# Altium project MCU099_LP-MSPM0L1306.PrjPcb (part 3 of 3)

## Sheet MCU099_04_XDS110_Target_Interface.SchDoc: XDS110-ET Interface
size 431 x 279 mm; DrawnBy: Johnson He; SheetNumber: 4; SheetTotal: 6; PageSetup: Record=PageOptions|CenterHorizontal=True|CenterVertical=True|PrintScale=0.97|XCorrection=1.00|YCorrection=1.00|PrintKind=0|BorderSize=5000000|LeftOffset=0|BottomOffset=0|Orientation=2|PaperLength=1000|PaperWidth=1000|Scale=100|PaperSource=15|PrintQuality=600|MediaType=1|DitherType=10|PaperKind=Letter|PrintScaleMode=1
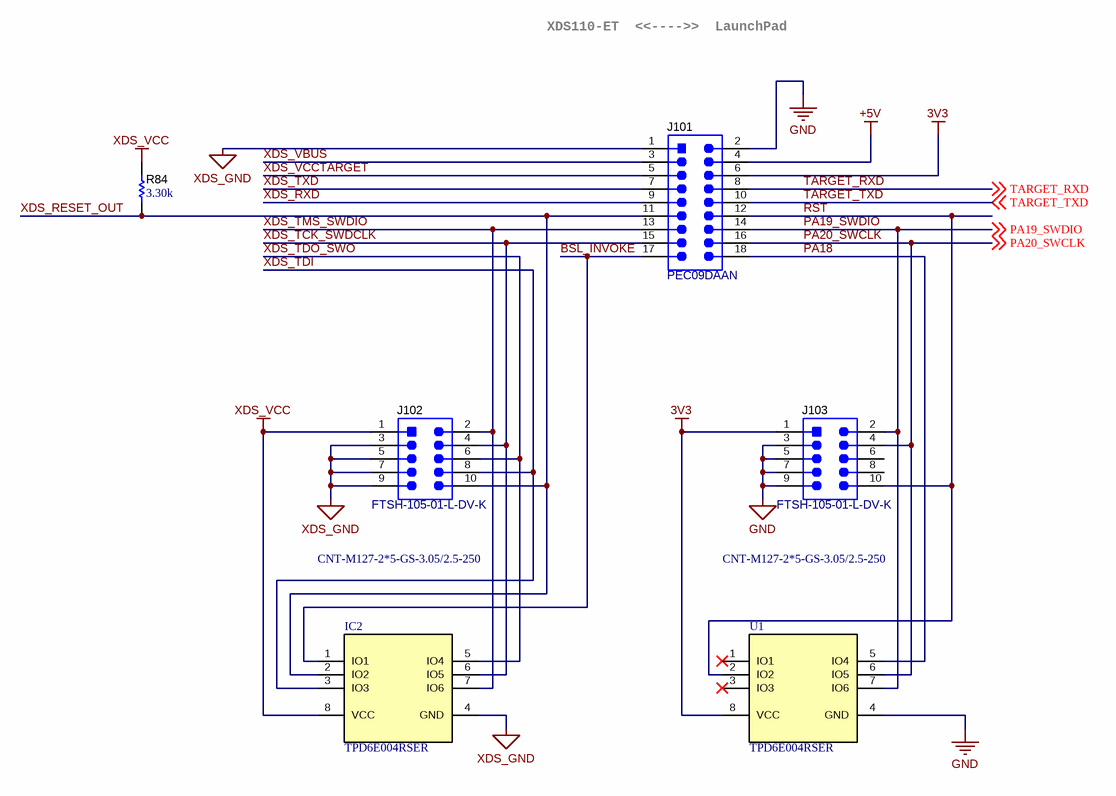
[diagram p3: MCU099_04_XDS110_Target_Interface.SchDoc]

### Parts
IC2  TPD6E004RSER  [RSE0008A]
J101  PEC09DAAN  [Sullins_PxC09DAAN]
J102  FTSH-105-01-L-DV-K  [Samtec_FTSH-105-01-x-DV-K]
J103  FTSH-105-01-L-DV-K  [Samtec_FTSH-105-01-x-DV-K]
R84  ValueDisplayed: 3.30k  [0402]  (hidden comment: ERJ-2RKF3301X)
U1  TPD6E004RSER  [RSE0008A]

### Nets
3V3: J101.6 J103.1 U1.8(VCC)
+5V: J101.4
GND: J101.2 J103.3 J103.5 J103.7 J103.9 U1.4(GND)
XDS_GND: IC2.4(GND) J101.1 J102.3 J102.5 J102.7 J102.9
XDS_VCC: IC2.8(VCC) J102.1 R84.2
BSL_INVOKE: IC2.1(IO1) J101.17
PA18: J101.18 U1.5(IO4)
PA19_SWDIO: J101.14 J103.2 U1.7(IO6) ; off-sheet PA19_SWDIO  [project net PA19]
PA20_SWCLK: J101.16 J103.4 U1.6(IO5) ; off-sheet PA20_SWCLK  [project net PA20]
~{RST}: J101.12 J103.10 U1.2(IO2)
TARGET_RXD: J101.8 ; off-sheet TARGET_RXD  [project net BC_RX]
TARGET_TXD: J101.10 ; off-sheet TARGET_TXD  [project net BC_TX]
XDS_RESET_OUT: IC2.2(IO2) J101.11 J102.10 R84.1
XDS_RXD: J101.9
XDS_TCK_SWDCLK: IC2.6(IO5) J101.15 J102.4
XDS_TDI: IC2.3(IO3) J102.8
XDS_TDO_SWO: IC2.5(IO4) J102.6
XDS_TMS_SWDIO: IC2.7(IO6) J101.13 J102.2
XDS_TXD: J101.7
XDS_VBUS: J101.3
XDS_VCCTARGET: J101.5

Not connected (* = marked no-connect by the designer): J103 6 8; U1 1(IO1)* 3(IO3)*

### Notes on the sheet
- XDS110-ET  <<---->>  LaunchPad
- CNT-M127-2*5-GS-3.05/2.5-250
- Drawn By:
- SVN Rev:
- Number:
- TID #:
- Orderable:
- Rev:
- Sheet Title:
- File:
- Project Title:
- Designed for:
- Assembly Variant:
- Mod. Date:
- Sheet:
- Size:
- of
- B
- http://www.ti.com
- Texas Instruments and/or its licensors do not warrant the accuracy or completeness of this specification or any information contained therein. Texas Instruments and/or its licensors do not warrant that this design will meet the specifications, will be suitable for your application or fit for any particular purpose, or will operate in an implementation. Texas Instruments and/or its licensors do not warrant that the design is production worthy. You should completely validate and test your design implementation to confirm the system functionality for your application.
- Engineer:
- Contact:
- © Texas Instruments

### Library data of the parts
IC2 U1 = CMP-0043125-2: Low-Capacitance + / - 15 kV ESD Protection Array for High-Speed Data Interfaces, 6 Channels, -40 to +85 degC, 8-pin UQFN (RSE), Green (RoHS & no Sb/Br); Manufacturer: Texas Instruments; IO Leakage Current(nA): 1; IO Capacitance(Typ)(pF): 1.6; 1394 / Firewire: TRUE; SubFamily: ESD Solution; Breakdown Voltage(Min)(V): 6; IEC 61000-4-2 Air-Gap(+/- kV): 12; IEC 61000-4-2 Contact(+/- kV): 8; ComponentLink1URL: http://www.ti.com/; PackageDescription: 8-Pin Plastic Quad Flatpack No-Lead, 1.5 x 1.5 mm Body, 0.5 mm Pitch; Serial ATA / eSATA: TRUE; ComponentLink2URL: http://www.ti.com/general/docs/lit/getliterature.tsp?genericPartNumber=TPD6E004&fileType=pdf; ComponentLink3Description: URL Link1; Eco-Plan: Green (RoHS & no Sb/Br); USB High Speed: TRUE; ComponentLink2Description: Datasheet; ComponentLink3URL: SamplesURL:http://www.ti.com/product/tpd6e004#samples; PackageReference: RSE0008A; DatasheetVersion: SLLS799A; PartNumber: TPD6E004RSER; PackageVersion: revD, Jan-2011; Mounting Technology: Surface Mount; ComponentLink1Description: Manufacturer URL
J101 = CMP-0054622-1: Header, 2.54mm, 9x2, Tin, TH; Manufacturer: Sullins Connector Solutions; CNHeader: TRUE; Current_A: 3A; Shrouded: N; Gender: Male; Row_Count: 2; RowSpacing_mm: 2.54; CT: FALSE; Cert_UL: Y; ComponentLink1URL: http://www.sullinscorp.com/catalogs/77_PAGE108-109_.100_MALE_HDR.pdf; ClassName: Header; Publisher: Texas Instruments; Color: Black; RoHS: Y; MountType: TH; Supplier 1: Digi-Key; PackageReference: Header, 2.54mm, 9x2, TH; PinCount: 18; CompType: Header; LatestRevisionDate: 26/05/2017; PartNumber: PEC09DAAN; Orientation: Vertical; ComponentLink1Description: Datasheet URL; Supplier Part Number 1: S2012E-09-ND; Pitch_mm: 2.54; ContactFinish: Tin
J102 J103 = CMP-0075634-1: Header(Shrouded), 1.27mm, 5x2, Gold, SMT; Manufacturer: Samtec; Pitch_mm: 1.27; Gender: Male; Cert_CSA: Y; Current_A: 3.3A; CT: False; Row_Count: 2; ComponentLink1Description: Datasheet URL; RoHS: Y; Supplier 1: Digi-Key; Cert_UL: Y; Orientation: Vertical; PackageReference: Header(Shrouded), 1.27mm, 5x2, SMT; Color: Black; PartNumber: FTSH-105-01-L-DV-K; PinCount: 10; Publisher: Texas Instruments; Supplier Part Number 2: 1872577; ContactFinish: Gold; Supplier 2: Farnell; Shrouded: Y; RowSpacing_mm: 1.27; ComponentLink1URL: http://suddendocs.samtec.com/prints/ftsh-1xx-xx-xxx-dv-xxx-mkt.pdf; LatestRevisionDate: 2017-07-12; CompType: Header; CNHeader: False; MountType: SMT; Supplier Part Number 1: SAM8799-ND
R84 = CMP-0026695-1: RES, 3.30 k, 1%, 0.1 W, AEC-Q200 Grade 0, 0402; Manufacturer: Panasonic; Power_W: 100mW; TempCo: 100 ppm/C; Value_Code: 3k30; U/M: EA; Value: 3.30k; Res_ohm: 3.3k; SizeX_mm: 1; SizeY_mm: 0.5; SizeZ_mm: 0.6; Value2: 0.1W; AEC Qualified: Y; VDC_V: 50V; AEC Grade: 0; AEC Category: Q200; ComponentLink1URL: http://industrial.panasonic.com/cdbs/www-data/pdf/RDA0000/AOA0000C86.pdf; Supplier Part Number 2: 64R5278; Publisher: Texas Instruments; Supplier 2: Newark; Supplier Part Number 3: 667-ERJ-2RKF3301X; Supplier 3: Mouser; Published: 2008-06-26; RoHS: Y; Value1: 1%; MountType: SMT; Supplier 1: Digi-Key; PackageReference: 0402; Tolerance_%: 1%; SizeArea_mm2: 0.5; CompType: Resistor; LatestRevisionDate: 2017-03-09; PartNumber: ERJ-2RKF3301X; ComponentLink1Description: Datasheet link; Supplier Part Number 1: P3.30KLCT-ND; Technology: Thick Film

## Sheet MCU099_05_XDS110-ET_USB_Power.SchDoc: XDS110-ET USB Power
size 431 x 279 mm; DrawnBy: Johnson He; SheetNumber: 5; SheetTotal: 6; PageSetup: Record=PageOptions|CenterHorizontal=True|CenterVertical=True|PrintScale=0.97|XCorrection=1.00|YCorrection=1.00|PrintKind=0|BorderSize=5000000|LeftOffset=0|BottomOffset=0|Orientation=2|PaperLength=1000|PaperWidth=1000|Scale=100|PaperSource=15|PrintQuality=600|MediaType=1|DitherType=10|PaperKind=Letter|PrintScaleMode=1
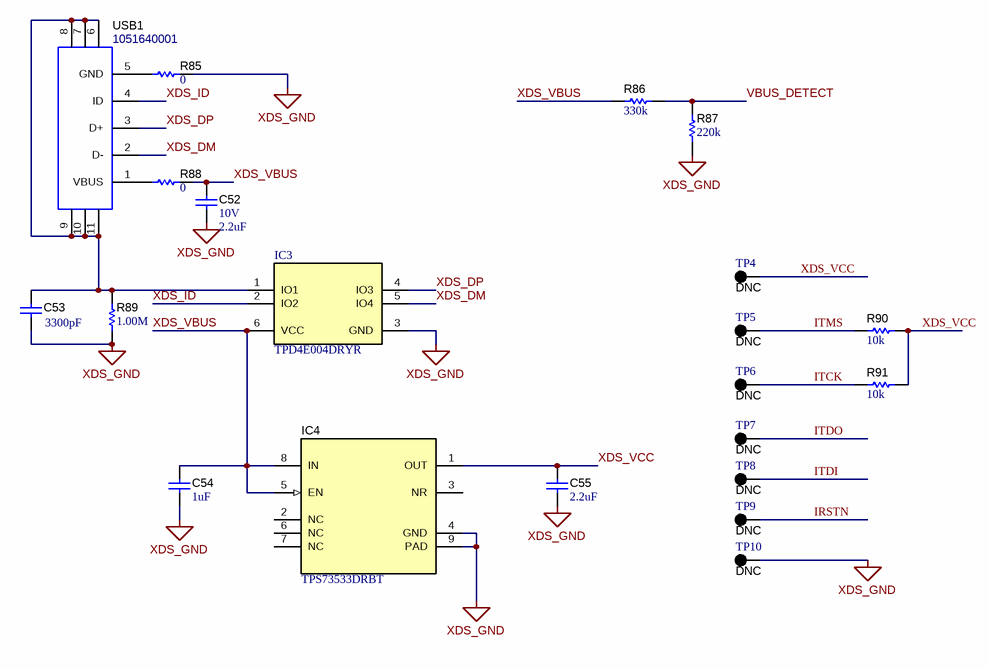
[diagram p4: MCU099_05_XDS110-ET_USB_Power.SchDoc]

### Parts
(Parts that share a designator on the sheet are numbered #1, #2 ... from top to bottom, then left to right.)
C52  VDC_V: 10V  ValueDisplayed: 2.2uF  [0603]  (hidden comment: C0603C225K8PACTU)
C53  ValueDisplayed: 3300pF  [0402]  (hidden comment: GRM155R71H332KA01D)
C54  ValueDisplayed: 1uF  [0402]  (hidden comment: C1005X5R1E105K050BC)
C55  ValueDisplayed: 2.2uF  [0402]  (hidden comment: GRM155R60J225KE95D)
IC3  TPD4E004DRYR  [DRY0006A]
IC4  TPS73533DRBT  [DRB0008A]
R85  ValueDisplayed: 0  [0603]  (hidden comment: RC0603JR-070RL)
R86  ValueDisplayed: 330k  [0402]  (hidden comment: RC0402FR-07330KL)
R87  ValueDisplayed: 220k  [0402]  (hidden comment: RC0402FR-07220KL)
R88  ValueDisplayed: 0  [0603]  (hidden comment: RC0603JR-070RL)
R89  ValueDisplayed: 1.00M  [0402]  (hidden comment: CRCW04021M00FKED)
R90  ValueDisplayed: 10k  [0402]  (hidden comment: CRCW040210K0JNED)
R91  ValueDisplayed: 10k  [0402]  (hidden comment: CRCW040210K0JNED)
TP4  DNC  [Keystone5001]  (no BOM)
TP5  DNC  [Keystone5001]  (no BOM)
TP6  DNC  [Keystone5001]  (no BOM)
TP7  DNC  [Keystone5001]  (no BOM)
TP8  DNC  [Keystone5001]  (no BOM)
TP9  DNC  [Keystone5001]  (no BOM)
TP10  DNC  [Keystone5001]  (no BOM)
USB1#1  1051640001  [Molex_1051640001]

### Nets
XDS_GND: C52.2 C53.2 C54.2 C55.2 IC3.3(GND) IC4.4(GND) IC4.9(PAD) R85.2 R87.1 R89.1 TP10.1
XDS_VCC: C55.1 IC4.1(OUT) R90.1 R91.1 TP4.1
IRSTN: TP9.1
ITCK: R91.2 TP6.1
ITDI: TP8.1
ITDO: TP7.1
ITMS: R90.2 TP5.1
VBUS_DETECT: R86.2 R87.2
XDS_DM: IC3.5(IO4) USB1#1.2(D-)
XDS_DP: IC3.4(IO3) USB1#1.3(D+)
XDS_ID: IC3.2(IO2) USB1#1.4(ID)
XDS_VBUS: C52.1 C54.1 IC3.6(VCC) IC4.5(EN) IC4.8(IN) R86.1 R88.2
NetC53_1: C53.1 IC3.1(IO1) R89.2 USB1#1.6 USB1#1.7 USB1#1.8 USB1#1.9 USB1#1.10 USB1#1.11
NetR85_1: R85.1 USB1#1.5(GND)
NetR88_1: R88.1 USB1#1.1(VBUS)

Not connected (* = marked no-connect by the designer): IC4 2(NC) 3(NR) 6(NC) 7(NC)

### Notes on the sheet
- Drawn By:
- SVN Rev:
- Number:
- TID #:
- Orderable:
- Rev:
- Sheet Title:
- File:
- Project Title:
- Designed for:
- Assembly Variant:
- Mod. Date:
- Sheet:
- Size:
- of
- B
- http://www.ti.com
- Texas Instruments and/or its licensors do not warrant the accuracy or completeness of this specification or any information contained therein. Texas Instruments and/or its licensors do not warrant that this design will meet the specifications, will be suitable for your application or fit for any particular purpose, or will operate in an implementation. Texas Instruments and/or its licensors do not warrant that the design is production worthy. You should completely validate and test your design implementation to confirm the system functionality for your application.
- Engineer:
- Contact:
- © Texas Instruments

### Library data of the parts
C52 = CMP-0006906-5: CAP, CERM, 2.2 uF, 10 V, +/- 10%, X5R, 0603; Manufacturer: Kemet; TaMin_C: -55°C; Polarized: N; SizeAreaWB_mm2: 4.68; Value1: Unknown; U/M: EA; Value: 2.2uF; TaMax_C: 85°C; SizeZ_mm: 1; SizeX_mm: 1.6; SizeY_mm: 0.8; SizeArea_mm2: 1.28; Cap_F: 2.2µF; AEC Category: Q200; Publisher: Texas Instruments; TempCo: X5R; Published: 2008-06-19; RoHS: Y; MountType: SMT; Supplier 1: Digi-Key; PackageReference: 0603; Tolerance_%: 10%; Cap_Case: 0603; Value2: 10V; CompType: Capacitor; LatestRevisionDate: 2017-03-09; PartNumber: C0603C225K8PACTU; AEC Qualified: ?; ComponentLink1Description: Datasheet link; Supplier Part Number 1: 399-4911-1-ND; Technology: Ceramic; ComponentLink1URL: http://www.kemet.com/kemet/web/homepage/kechome.nsf/vapubfiles/F3102_Y5V.pdf/$file/F3102_Y5V.pdf; Supplier 2: Mouser; Supplier 3: Farnell; Supplier Part Number 2: 80-C0603C225K8P; Supplier Part Number 3: 1108322
C53 = CMP-0006688-2: CAP, CERM, 3300 pF, 50 V, +/- 10%, X7R, 0402; Manufacturer: MuRata; TaMin_C: -55°C; Polarized: N; SizeAreaWB_mm2: 3; Value1: Unknown; U/M: EA; Value: 3300pF; TaMax_C: 125°C; SizeZ_mm: 0.6; SizeX_mm: 1; SizeY_mm: 0.5; Value2: 50V; Cap_F: 3.3nF; AEC Category: Q200; Supplier Part Number 2: 81-GRM36X332K50; Publisher: Texas Instruments; Supplier 2: Mouser; TempCo: X7R; Published: 2008-06-19; RoHS: Y; MountType: SMT; Supplier 1: Digi-Key; PackageReference: 0402; Tolerance_%: 10%; Cap_Case: 0402; SizeArea_mm2: 0.5; CompType: Capacitor; LatestRevisionDate: 2017-03-09; PartNumber: GRM155R71H332KA01D; AEC Qualified: ?; VDC_V: 50V; ComponentLink1Description: Datasheet link; Supplier Part Number 1: 490-3248-1-ND; Technology: Ceramic; ComponentLink1URL: http://search.murata.co.jp/Ceramy/PnsearchViewAction.do?HnOFG=ON&HnNFG=ON&SEL_CNT=50&sLang=en&sKey=GRM155R71H332KA01D&x=9&y=9&search=startwith
C54 = CMP-0006276-2: CAP, CERM, 1 uF, 25 V, +/- 10%, X5R, 0402; Manufacturer: TDK; TaMin_C: -55°C; Polarized: N; SizeAreaWB_mm2: 3; Value1: Unknown; U/M: EA; Value: 1uF; TaMax_C: 80°C; SizeZ_mm: 0.6; SizeX_mm: 1; SizeY_mm: 0.5; Value2: 25V; Cap_F: 1µF; AEC Category: Q200; ComponentLink1URL: https://product.tdk.com/info/en/catalog/datasheets/mlcc_commercial_general_en.pdf; Supplier Part Number 2: 07W9127; Publisher: Texas Instruments; Supplier 2: Newark; Supplier Part Number 3: 810-C1005X5R1E105K; TempCo: X5R; Supplier 3: Mouser; Published: 2008-06-19; RoHS: Y; MountType: SMT; Supplier 1: Digi-Key; PackageReference: 0402; Tolerance_%: 10%; Cap_Case: 0402; SizeArea_mm2: 0.5; CompType: Capacitor; PartNumber: C1005X5R1E105K050BC; AEC Qualified: N; VDC_V: 25V; ComponentLink1Description: Datasheet link; Supplier Part Number 1: 445-9066-1-ND; LatestRevisionDate: 2017-03-09; Technology: Ceramic; AEC Grade: N/A
C55 = CMP-0006543-2: CAP, CERM, 2.2 uF, 6.3 V, +/- 10%, X5R, 0402; Manufacturer: MuRata; TaMin_C: -55°C; Polarized: N; SizeAreaWB_mm2: 3; Value1: Unknown; U/M: EA; Value: 2.2uF; TaMax_C: 85°C; SizeZ_mm: 0.6; SizeX_mm: 1; SizeY_mm: 0.5; Value2: 6.3V; Cap_F: 2.2µF; AEC Category: Q200; Publisher: Texas Instruments; TempCo: X5R; Published: 2008-06-19; RoHS: Y; MountType: SMT; Supplier 1: Mouser; PackageReference: 0402; Tolerance_%: 10%; Cap_Case: 0402; SizeArea_mm2: 0.5; CompType: Capacitor; LatestRevisionDate: 2017-03-09; PartNumber: GRM155R60J225KE95D; AEC Qualified: N; VDC_V: 6.3V; ComponentLink1Description: Datasheet link; AEC Grade: N/A; Supplier Part Number 1: 81-GRM155R60J225KE5D; Technology: Ceramic; ComponentLink1URL: http://psearch.en.murata.com/capacitor/product/GRM155R60J225KE95%23.pdf
IC3 = CMP-0043115-1: ESD-Protection Array for High-Speed Data Interfaces, 4 Channels, -40 to +85 degC, 6-pin SON (DRY), Green (RoHS & no Sb/Br); Manufacturer: Texas Instruments; IO Leakage Current(nA): 1; USB High Speed: TRUE; IO Capacitance(Typ)(pF): 1.6; SubFamily: ESD Solution; IEC 61000-4-2 Contact(+/- kV): 8; Breakdown Voltage(Min)(V): 6; IEC 61000-4-2 Air-Gap(+/- kV): 12; PackageVersion: revF, Dec-2011; ComponentLink3URL: SamplesURL:http://www.ti.com/product/tpd4e004#samples; DatasheetVersion: SLVS729A; Eco-Plan: Green (RoHS & no Sb/Br); ComponentLink1Description: Manufacturer URL; Mounting Technology: Surface Mount; ComponentLink2URL: http://www.ti.com/general/docs/lit/getliterature.tsp?genericPartNumber=TPD4E004&fileType=pdf; ComponentLink1URL: http://www.ti.com/; PackageDescription: 6-Pin Plastic Small Outline No-Lead, 1 x 1.45 x 0.6 mm Body, 0.5 mm Pitch; 1394 / Firewire: TRUE; PackageReference: DRY0006A; ComponentLink3Description: URL Link1; ComponentLink2Description: Datasheet; Serial ATA / eSATA: TRUE; PartNumber: TPD4E004DRYR
IC4 = CMP-0036329-3: 500mA, Adjustable, Low Quiescent Current, Low-Noise, High-PSRR, Single-Output LDO Regulator, DRB0008A (VSON-8); Manufacturer: Texas Instruments; AEC Category: Q200; Vout Adj(Max)(V): 3.3; Vdo(Typ)(mV): 280; SizeY_mm: 3.0; Vin(Max)(V): 6.5; Accuracy(%): 2; Vin(Min)(V): 2.7; SizeAreaWB_mm2: 16.0; SizeZ_mm: 1.0; AEC Qualified: N; SizeArea_mm2: 9.0; Iout(Max)(A): 0.5; Rating: Catalog; Iq(Typ)(mA): 0.04; CompType: IC; MountType: SMT; PackageReference: DRB0008A; Fixed Output Options(V): 3.3; RoHS: Y; SizeX_mm: 3.0; ComponentLink2URL: http://www.ti.com/product/tps735; ComponentLink2Description: Product Folder; Operating Temperature Range: -40 to 125 C; PartNumber: TPS73533DRBT; ComponentLink3Description: Online Datasheet; ComponentLink1Description: Datasheet Link; ComponentLink1URL: http://www.ti.com/lit/ds/symlink/tps735.pdf; PackageDescription: VSON-8; Vout Adj(Min)(V): 3.3; ComponentLink3URL: http://www.ti.com/product/tps735/datasheet
R85 R88 = CMP-0025885-5: RES, 0, 5%, 0.1 W, 0603; Manufacturer: Yageo; Power_W: 100mW; TempCo: 200 ppm/C; Value_Code: 0000; Value: 0; EIA_Code: E24; SizeX_mm: 1.6; SizeZ_mm: 1; Value2: 0.1W; SizeArea_mm2: 1.28; AEC Qualified: N; VDC_V: 75V; AEC Category: Q200; SizeY_mm: 0.8; SizeAreaWB_mm2: 4.68; Supplier Part Number 2: 603-RC0603JR-070RL; Supplier 2: Mouser; Supplier Part Number 3: 9233130; Supplier 3: Farnell; RoHS: Y; Value1: 5%; MountType: SMT; Supplier 1: Digi-Key; PackageReference: 0603; Tolerance_%: 5%; Res_ohm: 0; CompType: Resistor; PartNumber: RC0603JR-070RL; ComponentLink1Description: Datasheet link; Supplier Part Number 1: 311-0.0GRCT-ND; Technology: Thick Film; ComponentLink1URL: http://www.yageo.com/pdf/Pu-RC0603_51_PbFree_L_2.pdf; AEC Grade: N/A
R86 = CMP-0026731-1: RES, 330 k, 1%, 0.0625 W, 0402; Manufacturer: Yageo America; Power_W: 62.5mW; TempCo: 100 ppm/C; U/M: EA; Value: 330k; SizeX_mm: 1; SizeY_mm: 0.5; SizeZ_mm: 0.6; AEC Qualified: N; VDC_V: 50V; AEC Category: Q200; ComponentLink1URL: http://www.yageo.com/documents/recent/PYu-RC0402_51_RoHS_L_6_r.pdf; Supplier Part Number 2: 98K7541; Publisher: Texas Instruments; Supplier 2: Newark; Supplier Part Number 3: 603-RC0402FR-07330KL; Supplier 3: Mouser; Published: 2008-06-26; Value_Code: 330k; RoHS: Y; Value1: 1%; MountType: SMT; Supplier 1: Digi-Key; PackageReference: 0402; Tolerance_%: 1%; Res_ohm: 330k; Value2: 0.0625W; SizeArea_mm2: 0.5; CompType: Resistor; LatestRevisionDate: 2017-03-09; PartNumber: RC0402FR-07330KL; ComponentLink1Description: Datasheet link; AEC Grade: N/A; Supplier Part Number 1: 311-330KLRCT-ND; Technology: Thick Film
R87 = CMP-0026728-1: RES, 220 k, 1%, 0.0625 W, 0402; Manufacturer: Yageo America; Power_W: 62.5mW; TempCo: 100 ppm/C; U/M: EA; Value: 220k; SizeX_mm: 1; SizeY_mm: 0.5; SizeZ_mm: 0.6; AEC Qualified: N; VDC_V: 50V; AEC Category: Q200; ComponentLink1URL: http://www.yageo.com/documents/recent/PYu-RC0402_51_RoHS_L_6_r.pdf; Supplier Part Number 2: 98K7527; Publisher: Texas Instruments; Supplier 2: Newark; Supplier Part Number 3: 603-RC0402FR-07220KL; Supplier 3: Mouser; Published: 2008-06-26; Value_Code: 220k; RoHS: Y; Value1: 1%; MountType: SMT; Supplier 1: Digi-Key; PackageReference: 0402; Tolerance_%: 1%; Res_ohm: 220k; Value2: 0.0625W; SizeArea_mm2: 0.5; CompType: Resistor; LatestRevisionDate: 2017-03-09; PartNumber: RC0402FR-07220KL; ComponentLink1Description: Datasheet link; AEC Grade: N/A; Supplier Part Number 1: 311-220KLRCT-ND; Technology: Thick Film
R89 = CMP-0026100-1: RES, 1.00 M, 1%, 0.063 W, 0402; Manufacturer: Vishay-Dale; Power_W: 63mW; TempCo: 100 ppm/C; Value_Code: 1M00; U/M: EA; Value: 1.00Meg; EIA_Code: E96; Res_ohm: 1M; SizeX_mm: 1; SizeY_mm: 0.5; SizeZ_mm: 0.6; Value2: 0.063W; VDC_V: 50V; AEC Category: Q200; ComponentLink1URL: http://www.vishay.com/docs/20035/dcrcwe3.pdf; Supplier Part Number 2: 52K6593; Publisher: Texas Instruments; Supplier 2: Newark; Supplier Part Number 3: 71-CRCW0402-1.0M-E3; Supplier 3: Mouser; Published: 2008-06-26; RoHS: Y; Value1: 1%; MountType: SMT; Supplier 1: Digi-Key; PackageReference: 0402; Tolerance_%: 1%; SizeArea_mm2: 0.5; CompType: Resistor; LatestRevisionDate: 2017-03-09; PartNumber: CRCW04021M00FKED; AEC Qualified: ?; ComponentLink1Description: Datasheet link; Supplier Part Number 1: 541-1.00MLCT-ND; Technology: Thick Film
R90 R91 = CMP-0026825-4: RES, 10 k, 5%, 0.063 W, 0402; Manufacturer: Vishay-Dale; Power_W: 63mW; TempCo: 200 ppm/C; Value_Code: 10k0; U/M: EA; Value: 10k; EIA_Code: E24; SizeX_mm: 1; SizeY_mm: 0.5; SizeZ_mm: 0.6; Value2: 0.063W; VDC_V: 50V; AEC Category: Q200; Supplier Part Number 2: 59M6696; Publisher: Texas Instruments; Supplier 2: Newark; Supplier Part Number 3: 71-CRCW0402J-10K-E3; Supplier 3: Mouser; Published: 2008-06-26; RoHS: Y; Value1: 5%; MountType: SMT; Supplier 1: Digi-Key; PackageReference: 0402; Tolerance_%: 5%; Res_ohm: 10k; SizeArea_mm2: 0.5; CompType: Resistor; LatestRevisionDate: 2017-03-09; PartNumber: CRCW040210K0JNED; AEC Qualified: ?; ComponentLink1Description: Datasheet link; Supplier Part Number 1: 541-10KJCT-ND; Technology: Thick Film; ComponentLink1URL: http://www.vishay.com/docs/20035/dcrcwe3.pdf
TP4-TP10 = CMP-0055138-1: Test Point, Miniature, Black, TH; Manufacturer: Keystone; CNHeader: FALSE; Green_Lifecycle: Active; Green_REACh: Passed; ContactFinish: Silver; CT: TRUE; ComponentLink1URL: http://www.keyelco.com/userAssets/file/M60-2p60.pdf; Supplier Part Number 2: 534-5001; Publisher: Texas Instruments; Supplier 2: Mouser; Color: Black; RoHS: Y; MountType: TH; Green_EU RoHS-2: Incomplete; Supplier 1: Digi-Key; Green_EU RoHS: Passed; PackageReference: Black Miniature Testpoint; CompType: Test Point; LatestRevisionDate: 26/05/2017; PartNumber: 5001; ComponentLink1Description: Datasheet URL; Supplier Part Number 1: 36-5001-ND
USB1#1 = CMP-0055311-1: Receptacle, USB 2.0, Micro B, 5 Position, R/A, SMT; Manufacturer: Molex; CNHeader: FALSE; Current_A: 1.8A; Gender: Female; Voltage_V: 30V; Pitch_mm: 0.65; ContactFinish: Gold; CT: TRUE; Cert_UL: Y; ComponentLink1URL: http://www.molex.com/pdm_docs/sd/1051640001_sd.pdf; Supplier Part Number 2: 99Y3224; Publisher: Texas Instruments; Supplier 2: Newark; Supplier Part Number 3: 538-105164-0001; Color: Black; Supplier 3: Mouser; RoHS: Y; MountType: SMT; Supplier 1: Digi-Key; PackageReference: Receptacle, USB 2.0, Micro B, 5 Pos, 0.65mm Pitch, R/A, SMT; PinCount: 5; CompType: USB; LatestRevisionDate: 26/05/2017; PartNumber: 1051640001; Orientation: R/A; ComponentLink1Description: Datasheet URL; Supplier Part Number 1: WM11263CT-ND

## Sheet MCU099_06_Hardware.SchDoc: Hardware
size 431 x 279 mm; Date: Not shown in title block; ApprovedBy: Not shown in title block; CheckedBy: Not shown in title block; Author: Not shown in title block; CompanyName: Not shown in title block; DrawnBy: Johnson He; Engineer: Not shown in title block; Organization: Not shown in title block; Address1: Not shown in title block; Address2: Not shown in title block; Address3: Not shown in title block; Address4: Not shown in title block; DocumentNumber: 1; Revision: Use project parameter SCH_Rev; SheetNumber: 6; SheetTotal: 6; PageSetup: Record=PageOptions|CenterHorizontal=True|CenterVertical=True|PrintScale=1.00|XCorrection=1.00|YCorrection=1.00|PrintKind=0|BorderSize=5000000|LeftOffset=0|BottomOffset=0|Orientation=2|PaperLength=1000|PaperWidth=1000|Scale=100|PaperSource=15|PrintQuality=600|MediaType=1|DitherType=10|PaperKind=Letter|PrintScaleMode=1; CurrentTime: Not shown in title block; CurrentDate: Not shown in title block; Time: Not shown in title block; DocumentFullPathAndName: Not shown in title block; DocumentName: Not shown in title block; ModifiedDate: Not shown in title block; ImagePath: Not shown in title block
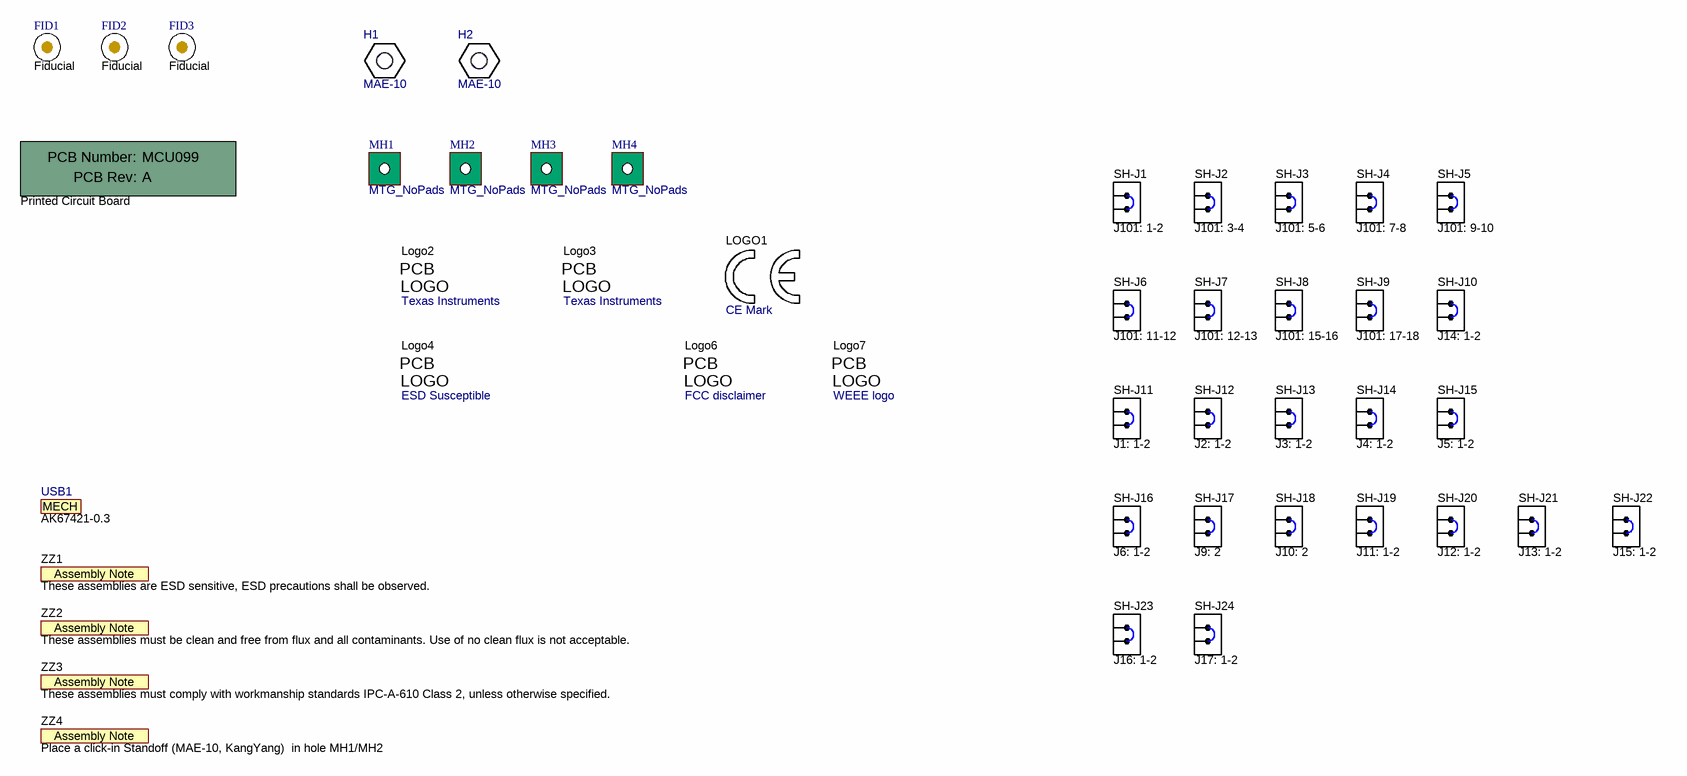
[diagram p5: MCU099_06_Hardware.SchDoc]

### Parts
(Parts that share a designator on the sheet are numbered #1, #2 ... from top to bottom, then left to right.)
!PCB1  Printed Circuit Board  (mechanical)
FID1  Fiducial  [Fiducial10-30]
FID2  Fiducial  [Fiducial10-30]
FID3  Fiducial  [Fiducial10-30]
H1  MAE-10  [KY_MAE-10]
H2  MAE-10  [KY_MAE-10]
LOGO1  CE Mark  [CE_Mark_5mm]  (no BOM)
Logo2  Texas Instruments  [TI_Horizontal_Overlay_Small]  (no BOM)
Logo3  Texas Instruments  [TI_Horizontal_Overlay_Medium]  (no BOM)
Logo4  ESD Susceptible  [ESD_Overlay_Large]  (no BOM)
Logo6  FCC disclaimer  [FCC_disclaimer]  (no BOM)
Logo7  WEEE logo  [WEEE_Minimum]  (no BOM)
MH1  MTG_NoPads  [NPTH125mil]  (no BOM)
MH2  MTG_NoPads  [NPTH125mil]  (no BOM)
MH3  MTG_NoPads  [NPTH125mil]  (no BOM)
MH4  MTG_NoPads  [NPTH125mil]  (no BOM)
SH-J1  value J101: 1-2  [SNT-100-BK-G]  (hidden comment: SNT-100-BK-G)
SH-J2  value J101: 3-4  [SNT-100-BK-G]  (hidden comment: SNT-100-BK-G)
SH-J3  value J101: 5-6  [SNT-100-BK-G]  (hidden comment: SNT-100-BK-G)
SH-J4  value J101: 7-8  [SNT-100-BK-G]  (hidden comment: SNT-100-BK-G)
SH-J5  value J101: 9-10  [SNT-100-BK-G]  (hidden comment: SNT-100-BK-G)
SH-J6  value J101: 11-12  [SNT-100-BK-G]  (hidden comment: SNT-100-BK-G)
SH-J7  value J101: 12-13  [SNT-100-BK-G]  (hidden comment: SNT-100-BK-G)
SH-J8  value J101: 15-16  [SNT-100-BK-G]  (hidden comment: SNT-100-BK-G)
SH-J9  value J101: 17-18  [SNT-100-BK-G]  (hidden comment: SNT-100-BK-G)
SH-J10  value J14: 1-2  [SNT-100-BK-G]  (hidden comment: SNT-100-BK-G)
SH-J11  value J1: 1-2  [SNT-100-BK-G]  (hidden comment: SNT-100-BK-G)
SH-J12  value J2: 1-2  [SNT-100-BK-G]  (hidden comment: SNT-100-BK-G)
SH-J13  value J3: 1-2  [SNT-100-BK-G]  (hidden comment: SNT-100-BK-G)
SH-J14  value J4: 1-2  [SNT-100-BK-G]  (hidden comment: SNT-100-BK-G)
SH-J15  value J5: 1-2  [SNT-100-BK-G]  (hidden comment: SNT-100-BK-G)
SH-J16  value J6: 1-2  [SNT-100-BK-G]  (hidden comment: SNT-100-BK-G)
SH-J17  value J9: 2  [SNT-100-BK-G]  (hidden comment: SNT-100-BK-G)
SH-J18  value J10: 2  [SNT-100-BK-G]  (hidden comment: SNT-100-BK-G)
SH-J19  value J11: 1-2  [SNT-100-BK-G]  (hidden comment: SNT-100-BK-G)
SH-J20  value J12: 1-2  [SNT-100-BK-G]  (hidden comment: SNT-100-BK-G)
SH-J21  value J13: 1-2  [SNT-100-BK-G]  (hidden comment: SNT-100-BK-G)
SH-J22  value J15: 1-2  [SNT-100-BK-G]  (hidden comment: SNT-100-BK-G)
SH-J23  value J16: 1-2  [SNT-100-BK-G]  (hidden comment: SNT-100-BK-G)
SH-J24  value J17: 1-2  [SNT-100-BK-G]  (hidden comment: SNT-100-BK-G)
USB1#2  AK67421-0.3  (mechanical)
ZZ1  These assemblies are ESD sensitive, ESD precautions shall be observed.  [AssemblyNote]  (no BOM)
ZZ2  These assemblies must be clean and free from flux and all contaminants. Use of no clean flux is not acceptable.  [AssemblyNote]  (no BOM)
ZZ3  These assemblies must comply with workmanship standards IPC-A-610 Class 2, unless otherwise specified.  [AssemblyNote]  (no BOM)
ZZ4  Place a click-in Standoff (MAE-10, KangYang)  in hole MH1/MH2  [AssemblyNote]  (no BOM)

### Notes on the sheet
- Drawn By:
- SVN Rev:
- Number:
- TID #:
- Orderable:
- Rev:
- Sheet Title:
- File:
- Project Title:
- Designed for:
- Assembly Variant:
- Mod. Date:
- Sheet:
- Size:
- of
- B
- http://www.ti.com
- Texas Instruments and/or its licensors do not warrant the accuracy or completeness of this specification or any information contained therein. Texas Instruments and/or its licensors do not warrant that this design will meet the specifications, will be suitable for your application or fit for any particular purpose, or will operate in an implementation. Texas Instruments and/or its licensors do not warrant that the design is production worthy. You should completely validate and test your design implementation to confirm the system functionality for your application.
- Engineer:
- Contact:
- © Texas Instruments
- (in symbol AssemblyNote) Assembly Note
- (in symbol CMP-0003618-2) PCB Number:; PCB Rev:
- (in symbol CMP-0074769-1) PCB; LOGO
- (in symbol CMP-0074838-1) PCB; LOGO
- (in symbol CMP-0074840-1) PCB; LOGO
- (in symbol CMP-0074847-1) PCB; LOGO
- (in symbol CMP-0077983-1) MECH

### Library data of the parts
!PCB1 = CMP-0003618-2: PartNumber: MCU099; Manufacturer: Any; LatestRevisionDate: 2017-03-09; CompType: PCB; Publisher: Texas Instruments; RoHS: O; MountType: N/A; Key: PCB
FID1-FID3 = CMP-0077181-1: Fiducial mark.  There is nothing to buy or mount.; CompType: Fiducial; PackageReference: N/A; Library Reference: Fiducial; ClassName: FiducialMark; Manufacturer: N/A; MountType: N/A; PartNumber: N/A
H1 H2 = CMP-0077978-1: Spacer Support, Nylon 66; Manufacturer: Kang Yang; CompType: Standoff; PartNumber: MAE-10; Key: MAE-10; PackageReference: Spacer Nylon Support; ComponentLink1Description: Datasheet Link; MountType: N/A; ComponentLink1URL: https://sps16.itg.ti.com/sites/KMS/crossdivteams/altium/docs/ComponentDatasheets/1104004000018---MAE-10.pdf; RoHS: Y
LOGO1 = CMP-0074844-1: SymbolCreator: a0412235; Publisher: Texas Instruments; Library Reference: CE Mark; Lib Reference: CE Mark; LatestRevisionDate: 2017-07-06; PartNumber: CE Mark; Published: 2009-03-03
Logo2 Logo3 = CMP-0074838-1: Texas Instrument Corporate Signature; SymbolCreator: a0412235; Lib Reference: TI_Logo; ClassName: Logo; Library Reference: Logo; Publisher: Texas Instruments; SymbolVersion: 2011-08-22; Published: 2009-03-03; LatestRevisionDate: 2017-07-06; PartNumber: Texas Instruments
Logo4 = CMP-0074840-1: ESD Susceptible Symbol; SymbolCreator: a0412235; Lib Reference: ESD_Susceptible; Library Reference: Logo; Publisher: Texas Instruments; SymbolVersion: 2011-08-22; Published: 2009-03-03; LatestRevisionDate: 2017-07-06; PartNumber: ESD Susceptible
Logo6 = CMP-0074847-1: FCC_disclaimer; Publisher: Texas Instruments; Lib Reference: FCC_disclaimer; Library Reference: Logo; LatestRevisionDate: 2017-07-06; PartNumber: FCC disclaimer; Published: 2009-03-03
Logo7 = CMP-0074769-1: Library Reference: WEEE logo; Lib Reference: WEEE logo; PartNumber: WEEE logo
MH1-MH4 = CMP-0078424-2: PCB Mounting Hole, No Pad; Manufacturer: Any; Key: Mounting Hole (non-standard) No Pad; CompType: Mounting Hole; PackageReference: Mounting Hole; PartNumber: N/A; MountType: N/A
SH-J1-SH-J24 = CMP-0003623-3: Shunt, 100mil, Gold plated, Black; Alternate PartNumber: 969102-0000-DA; Manufacturer: Samtec; Alternate Manufacturer: 3M; ComponentLink1URL: http://www.samtec.com/ftppub/pdf/SNT.PDF; Supplier 1: Digi-Key; CompType: Shunt; PackageReference: Shunt; ClassName: Shunt; RoHS: Y; Supplier Part Number 1: SAM8858-ND; MountType: N/A; PartNumber: SNT-100-BK-G; ComponentLink1Description: Datasheet Link
USB1#2 = CMP-0077983-1: Cable, USB-A to micro USB-B, 0.3 m; Manufacturer: Assman WSW; ComponentLink1URL: http://www.assmann-wsw.com/fileadmin/datasheets/ASS_7091_CA.pdf; Key: AK67421-0.3; CompType: Cable; Supplier 1: Digi-Key; RoHS: Y; Supplier Part Number 1: AE11229-ND; PartNumber: AK67421-0.3; MountType: N/A; ComponentLink1Description: Datasheet Link
ZZ1-ZZ4 = AssemblyNote: SymbolCreator: codlsc; SymbolVersion: 2010-05-18; CompType: AssemblyNote; ClassName: AssemblyNote; Publisher: Texas Instruments; LatestRevisionDate: 2012-06-14; LatestRevisionNote: Initial Version; Alternate Manufacturer: -; Alternate PartNumber: -

## Nets that join several sheets
3V3: MCU099_01_MSPM0L1306_Target_Device (13 pins), MCU099_04_XDS110_Target_Interface (J101.6 J103.1 U1.8)
+5V: MCU099_01_MSPM0L1306_Target_Device (5 pins), MCU099_04_XDS110_Target_Interface (J101.4)
GND: MCU099_01_MSPM0L1306_Target_Device (36 pins), MCU099_04_XDS110_Target_Interface (6 pins)
XDS_GND: MCU099_02_XDS110_Debug_Probe (37 pins), MCU099_03_XDS110-ET_EnergyTrace (27 pins), MCU099_04_XDS110_Target_Interface (6 pins), MCU099_05_XDS110-ET_USB_Power (11 pins)
XDS_VCC: MCU099_02_XDS110_Debug_Probe (26 pins), MCU099_03_XDS110-ET_EnergyTrace (11 pins), MCU099_04_XDS110_Target_Interface (IC2.8 J102.1 R84.2), MCU099_05_XDS110-ET_USB_Power (5 pins)
BC_RX: MCU099_01_MSPM0L1306_Target_Device (J17.1), MCU099_04_XDS110_Target_Interface (J101.8)
BC_TX: MCU099_01_MSPM0L1306_Target_Device (J16.1), MCU099_04_XDS110_Target_Interface (J101.10)
BSL_INVOKE: MCU099_02_XDS110_Debug_Probe (XDS1.42), MCU099_04_XDS110_Target_Interface (IC2.1 J101.17)
DCDCIO0: MCU099_02_XDS110_Debug_Probe (XDS1.5), MCU099_03_XDS110-ET_EnergyTrace (XDS2.4)
DCDCIO1: MCU099_02_XDS110_Debug_Probe (XDS1.6), MCU099_03_XDS110-ET_EnergyTrace (XDS2.5)
DCDCPULSE: MCU099_02_XDS110_Debug_Probe (XDS1.127), MCU099_03_XDS110-ET_EnergyTrace (R48.2 XDS2.3)
DCDCRST: MCU099_02_XDS110_Debug_Probe (TP1.1 XDS1.11), MCU099_03_XDS110-ET_EnergyTrace (C34.1 R46.1 XDS2.9)
DCDCTEST: MCU099_02_XDS110_Debug_Probe (TP3.1 XDS1.27), MCU099_03_XDS110-ET_EnergyTrace (R47.2 XDS2.10)
HOSTSCL: MCU099_02_XDS110_Debug_Probe (XDS1.49), MCU099_03_XDS110-ET_EnergyTrace (R43.1 XDS2.7)
HOSTSDA: MCU099_02_XDS110_Debug_Probe (XDS1.50), MCU099_03_XDS110-ET_EnergyTrace (R42.1 XDS2.8)
IRSTN: MCU099_02_XDS110_Debug_Probe (R34.1), MCU099_05_XDS110-ET_USB_Power (TP9.1)
ITCK: MCU099_02_XDS110_Debug_Probe (XDS1.100), MCU099_05_XDS110-ET_USB_Power (R91.2 TP6.1)
ITDI: MCU099_02_XDS110_Debug_Probe (XDS1.98), MCU099_05_XDS110-ET_USB_Power (TP8.1)
ITDO: MCU099_02_XDS110_Debug_Probe (XDS1.97), MCU099_05_XDS110-ET_USB_Power (TP7.1)
ITMS: MCU099_02_XDS110_Debug_Probe (XDS1.99), MCU099_05_XDS110-ET_USB_Power (R90.2 TP5.1)
PA18: MCU099_01_MSPM0L1306_Target_Device (J1/J3.26 J11.2 MSP1.22), MCU099_04_XDS110_Target_Interface (J101.18 U1.5)
PA19: MCU099_01_MSPM0L1306_Target_Device (J2/J4.17 MSP1.23), MCU099_04_XDS110_Target_Interface (J101.14 J103.2 U1.7)
PA20: MCU099_01_MSPM0L1306_Target_Device (J2/J4.13 MSP1.24), MCU099_04_XDS110_Target_Interface (J101.16 J103.4 U1.6)
~{RST}: MCU099_01_MSPM0L1306_Target_Device (5 pins), MCU099_04_XDS110_Target_Interface (J101.12 J103.10 U1.2)
REF_MAIN_LDO: MCU099_02_XDS110_Debug_Probe (XDS1.128), MCU099_03_XDS110-ET_EnergyTrace (R52.1 R55.2)
REF_TARGET_VCC: MCU099_02_XDS110_Debug_Probe (XDS1.120), MCU099_03_XDS110-ET_EnergyTrace (R51.1 R54.2)
VBUS_DETECT: MCU099_02_XDS110_Debug_Probe (XDS1.1), MCU099_05_XDS110-ET_USB_Power (R86.2 R87.2)
VCCEN1: MCU099_02_XDS110_Debug_Probe (TP2.1 XDS1.78), MCU099_03_XDS110-ET_EnergyTrace (IC1.1 R50.2)
XDS_DM: MCU099_02_XDS110_Debug_Probe (XDS1.93), MCU099_05_XDS110-ET_USB_Power (IC3.5 USB1#1.2)
XDS_DP: MCU099_02_XDS110_Debug_Probe (XDS1.94), MCU099_05_XDS110-ET_USB_Power (IC3.4 USB1#1.3)
XDS_ID: MCU099_02_XDS110_Debug_Probe (XDS1.95), MCU099_05_XDS110-ET_USB_Power (IC3.2 USB1#1.4)
XDS_RESET_OUT: MCU099_02_XDS110_Debug_Probe (XDS1.40), MCU099_04_XDS110_Target_Interface (IC2.2 J101.11 J102.10 R84.1)
XDS_RXD: MCU099_02_XDS110_Debug_Probe (XDS1.33), MCU099_04_XDS110_Target_Interface (J101.9)
XDS_TCK_SWDCLK: MCU099_02_XDS110_Debug_Probe (XDS1.35), MCU099_04_XDS110_Target_Interface (IC2.6 J101.15 J102.4)
XDS_TDI: MCU099_02_XDS110_Debug_Probe (XDS1.38), MCU099_04_XDS110_Target_Interface (IC2.3 J102.8)
XDS_TDO_SWO: MCU099_02_XDS110_Debug_Probe (XDS1.37), MCU099_04_XDS110_Target_Interface (IC2.5 J102.6)
XDS_TMS_SWDIO: MCU099_02_XDS110_Debug_Probe (XDS1.36), MCU099_04_XDS110_Target_Interface (IC2.7 J101.13 J102.2)
XDS_TXD: MCU099_02_XDS110_Debug_Probe (XDS1.34), MCU099_04_XDS110_Target_Interface (J101.7)
XDS_VBUS: MCU099_02_XDS110_Debug_Probe (R28.1), MCU099_03_XDS110-ET_EnergyTrace (5 pins), MCU099_04_XDS110_Target_Interface (J101.3), MCU099_05_XDS110-ET_USB_Power (7 pins)
XDS_VCCTARGET: MCU099_03_XDS110-ET_EnergyTrace (C38.1 C39.1 IC1.4 R51.2), MCU099_04_XDS110_Target_Interface (J101.5)

## Assembly variants
Variant 1: not fitted C8 C9 C10 C11 C12 C57 R4 R27 R51 R54 R93 R94 R95 TP1 TP2 TP3 TP4 TP5 TP6 TP7 TP8 TP9 TP10